# EAGLE design hotellock (EAGLE 6.5.0)
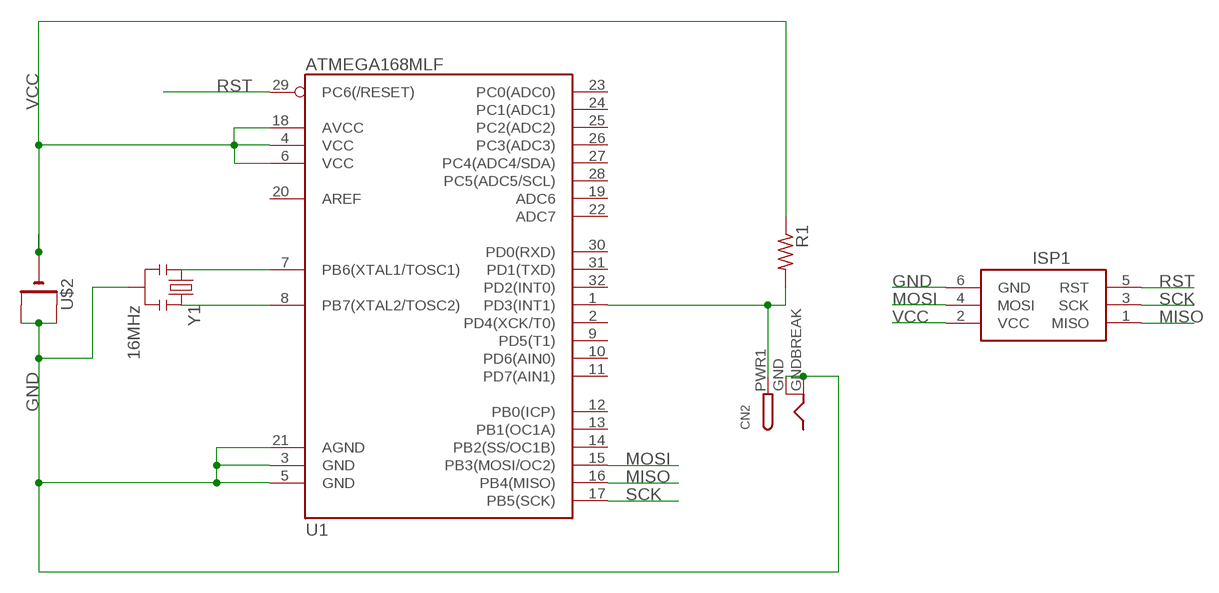
[diagram p0: schematic, sheet 1]

## Parts
CN2  DCBARRELSMT  [DCJACK_2MM_SMT]
ISP1  AVRISP-6  [AVRISP]
R1  R-US_R0805  [R0805]
U1  ATMEGA168MLF  [MLF32]
U$2  CR1220SMT  [CR1220-SMD]
Y1  16MHz  RESONATOR16MHZ  [RESONATOR-SMD]

## Nets
GND: CN2.GND(GNDBREAK) CN2.GNDBREAK(GND) ISP1.6(GND) U1.3(GND) U1.21(AGND) U$2.+$1(+) U$2.+$2(+1) Y1.2
MISO: ISP1.1(MISO) U1.16(PB4(MISO))
MOSI: ISP1.4(MOSI) U1.15(PB3(MOSI/OC2))
N$3: U1.8(PB7(XTAL2/TOSC2)) Y1.3
N$4: U1.7(PB6(XTAL1/TOSC1)) Y1.1
N$6: CN2.PWR1(PWR) R1.2 U1.1(PD3(INT1))
RST: ISP1.5(RST) U1.29(PC6(/RESET))
SCK: ISP1.3(SCK) U1.17(PB5(SCK))
VCC: ISP1.2(VCC) R1.1 U1.6(VCC) U1.18(AVCC) U$2.-
Unconnected: U1.2(PD4(XCK/T0)) U1.4(VCC) U1.5(GND) U1.9(PD5(T1)) U1.10(PD6(AIN0)) U1.11(PD7(AIN1)) U1.12(PB0(ICP)) U1.13(PB1(OC1A)) U1.14(PB2(SS/OC1B)) U1.19(ADC6) U1.20(AREF) U1.22(ADC7) U1.23(PC0(ADC0)) U1.24(PC1(ADC1)) U1.25(PC2(ADC2)) U1.26(PC3(ADC3)) U1.27(PC4(ADC4/SDA)) U1.28(PC5(ADC5/SCL)) U1.30(PD0(RXD)) U1.31(PD1(TXD)) U1.32(PD2(INT0))

## Library data of the parts
CN2 = adafruit:DCBARREL: 2.0mm DC Barrel Jack DCJACK_2MM_PTH - Through Hole Jack (4UConnector: 05537)
ISP1 = adafruit:AVRISP: AVR ISP HEADER Standard 6 pin header for AVR programming
R1 = adafruit:R-US_: RESISTOR, American symbol
U1 = SparkFun-DigitalIC:ATMEGA168: Atmel 32-pin 8-bit micro, 16k flash.
U$2 = adafruit:CR1220: CR1216/CR1220/CR1225 12mm 3V lithium coin cell Great for battery packup. Both SMT and THM holders. Note the THM package has the ground pads on both sides of the PCB so that the masks are the same - this reduces the cost
Y1 = SparkFun-FreqCtrl:RESONATOR: Resonator Small SMD resonator. Used, eg, on the Arduino Pro/ Pro Mini boards. 8MHz- XTAL-08895 16MHz- XTAL-08900; PROD_ID: XTAL-08900

## Board
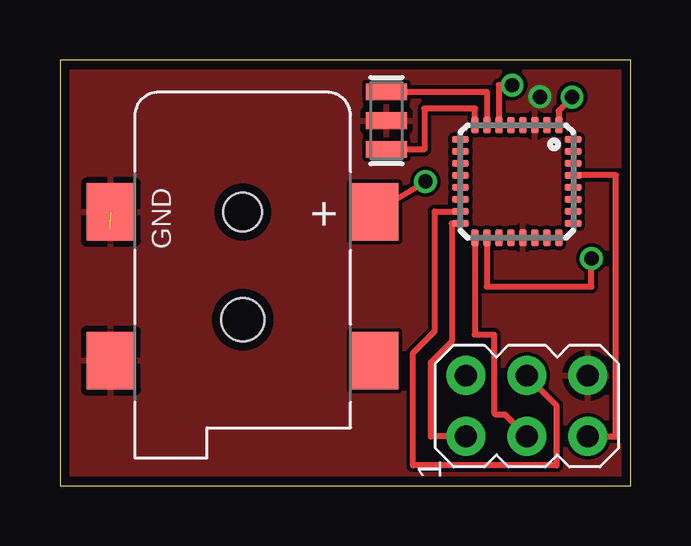
[diagram p1: board, top side]
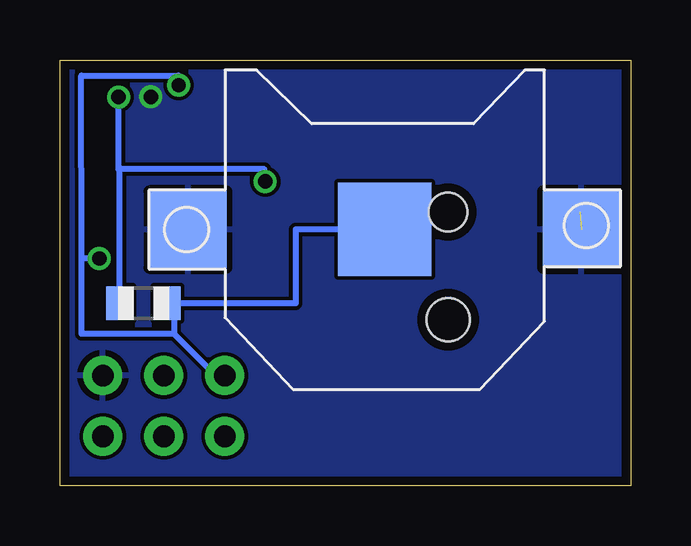
[diagram p2: board, bottom side, seen from below]

Size 23.8 x 17.77 mm. Coordinates in mm from the lower left corner, seen from the top.
Outline: 0,0 23.8,0 23.8,17.77 0,17.77 0,0
Copper layers (1*16): Top 0.0356mm / dielectric 1.5011mm / Bottom 0.0356mm
Design rules "OSHPark": minimum track width 6mil, minimum drill 13mil, track to track 6mil, track to pad 6mil, pad to pad 6mil, via to via 6mil, smd to smd 6mil, copper to edge 15mil, drill to drill 6mil, minimum pad ring 7mil, minimum via ring 7mil, stop-mask expansion 3mil, vias tented up to drill 0mil, thermal gap 10mil

### Footprints (pad centres in the part's own frame; a part is rotated, then mirrored left to right if it is on the bottom)
DCJACK_2MM_SMT = smd 2.4 x 2: GND 0,-5.5; GNDBREAK 6.2,-5.5; PWR1 0,5.5; PWR2 6.2,5.5 | hole 1.6: 0,0 | hole 1.8: 4.5,0
AVRISP = drill 0.9 pad 1.626: 1 -1.27,2.54; 2 1.27,2.54; 3 -1.27,0; 4 1.27,0; 5 -1.27,-2.54; 6 1.27,-2.54
R0805 = smd 1.1 x 1.4: 1 -1,0; 2 1,0
MLF32 = smd 0.7 x 0.3: 1 -2.35,1.75; 2 -2.35,1.25; 3 -2.35,0.75; 4 -2.35,0.25; 5 -2.35,-0.25; 6 -2.35,-0.75; 7 -2.35,-1.25; 8 -2.35,-1.75; 17 2.35,-1.75; 18 2.35,-1.25; 19 2.35,-0.75; 20 2.35,-0.25; 21 2.35,0.25; 22 2.35,0.75; 23 2.35,1.25; 24 2.35,1.75 | smd 0.3 x 0.7: 9 -1.75,-2.35; 10 -1.25,-2.35; 11 -0.75,-2.35; 12 -0.25,-2.35; 13 0.25,-2.35; 14 0.75,-2.35; 15 1.25,-2.35; 16 1.75,-2.35; 25 1.75,2.35; 26 1.25,2.35; 27 0.75,2.35; 28 0.25,2.35; 29 -0.25,2.35; 30 -0.75,2.35; 31 -1.25,2.35; 32 -1.75,2.35
CR1220-SMD = smd 3.2 x 3.2: +$1 -8.2,0; +$2 8.2,0 | smd 3.9 x 3.9: - 0,0
RESONATOR-SMD = smd 0.7 x 1.7: 1 -1.2,0; 2 0,0; 3 1.2,0

### Placement (x,y rotation side)
CN2  7.62,11.43 270 top
ISP1  19.47,3.34 90 top
R1  20.32,7.62 180 bottom
U1  19.05,12.7 270 top
U$2  10.26,10.7 0 bottom
Y1  13.61,15.24 270 top

### Tracks (layer width: path | path; a pad name or v marks a point on that pad's centre or on a via)
GND  (via drill 0.6)  (1 unrouted)
  other vias: 20.02,16.23
  pour Bottom: 0,17.78 0,0 27.94,0 27.94,17.78
  pour Top: 0,17.78 0,0 27.94,0 27.94,17.78
MISO
  Top 0.254: ISP1.1 15.46,2.07 15.46,5.15 16.34,6.03 16.34,10.95 U1.16
MOSI
  Top 0.254: ISP1.4 19.47,4.59 20.7,3.36 20.7,0.86 14.72,0.86 14.72,5.54 15.63,6.46 15.63,11.43 15.62,11.45 U1.15
N$3
  Top 0.254: U1.8 17.3,15.74 15.2,15.74 15.2,14.04 Y1.3 | Y1.3
N$4
  Top 0.254: Y1.1 17.8,16.44 U1.7
N$6  (via drill 0.6)
  Top 0.254: CN2.PWR1 v15.24,12.7 | v21.36,16.22 20.8,15.65 U1.1
  Bottom 0.254: v15.24,12.7 15.27,12.7 15.27,13.21 21.32,13.21 | v21.36,16.22 21.36,13.21 21.32,13.21 | R1.2 21.32,13.21
RST
  Top 0.254: ISP1.5 23.18,2.07 23.18,12.97 21.4,12.97 U1.29
SCK
  Top 0.254: U1.17 17.3,6.31 18.1,6.31 18.1,3.06 18.17,2.98 18.55,2.98 ISP1.3
VCC  (via drill 0.6)
  Top 0.254: v18.85,16.72 18.3,16.72 U1.6 | U1.18 17.8,8.31 22.16,8.31 v22.16,9.49
  Bottom 0.254: 19.05,6.35 19.05,7.62 R1.1 13.97,7.62 13.97,10.7 U$2.- | 19.05,6.35 22.9,6.35 22.9,9.42 | 22.9,9.42 22.91,17.12 18.87,17.12 v18.85,16.72 | ISP1.2 17.31,4.61 19.05,6.35 | v22.16,9.49 22.9,9.49 22.9,9.42